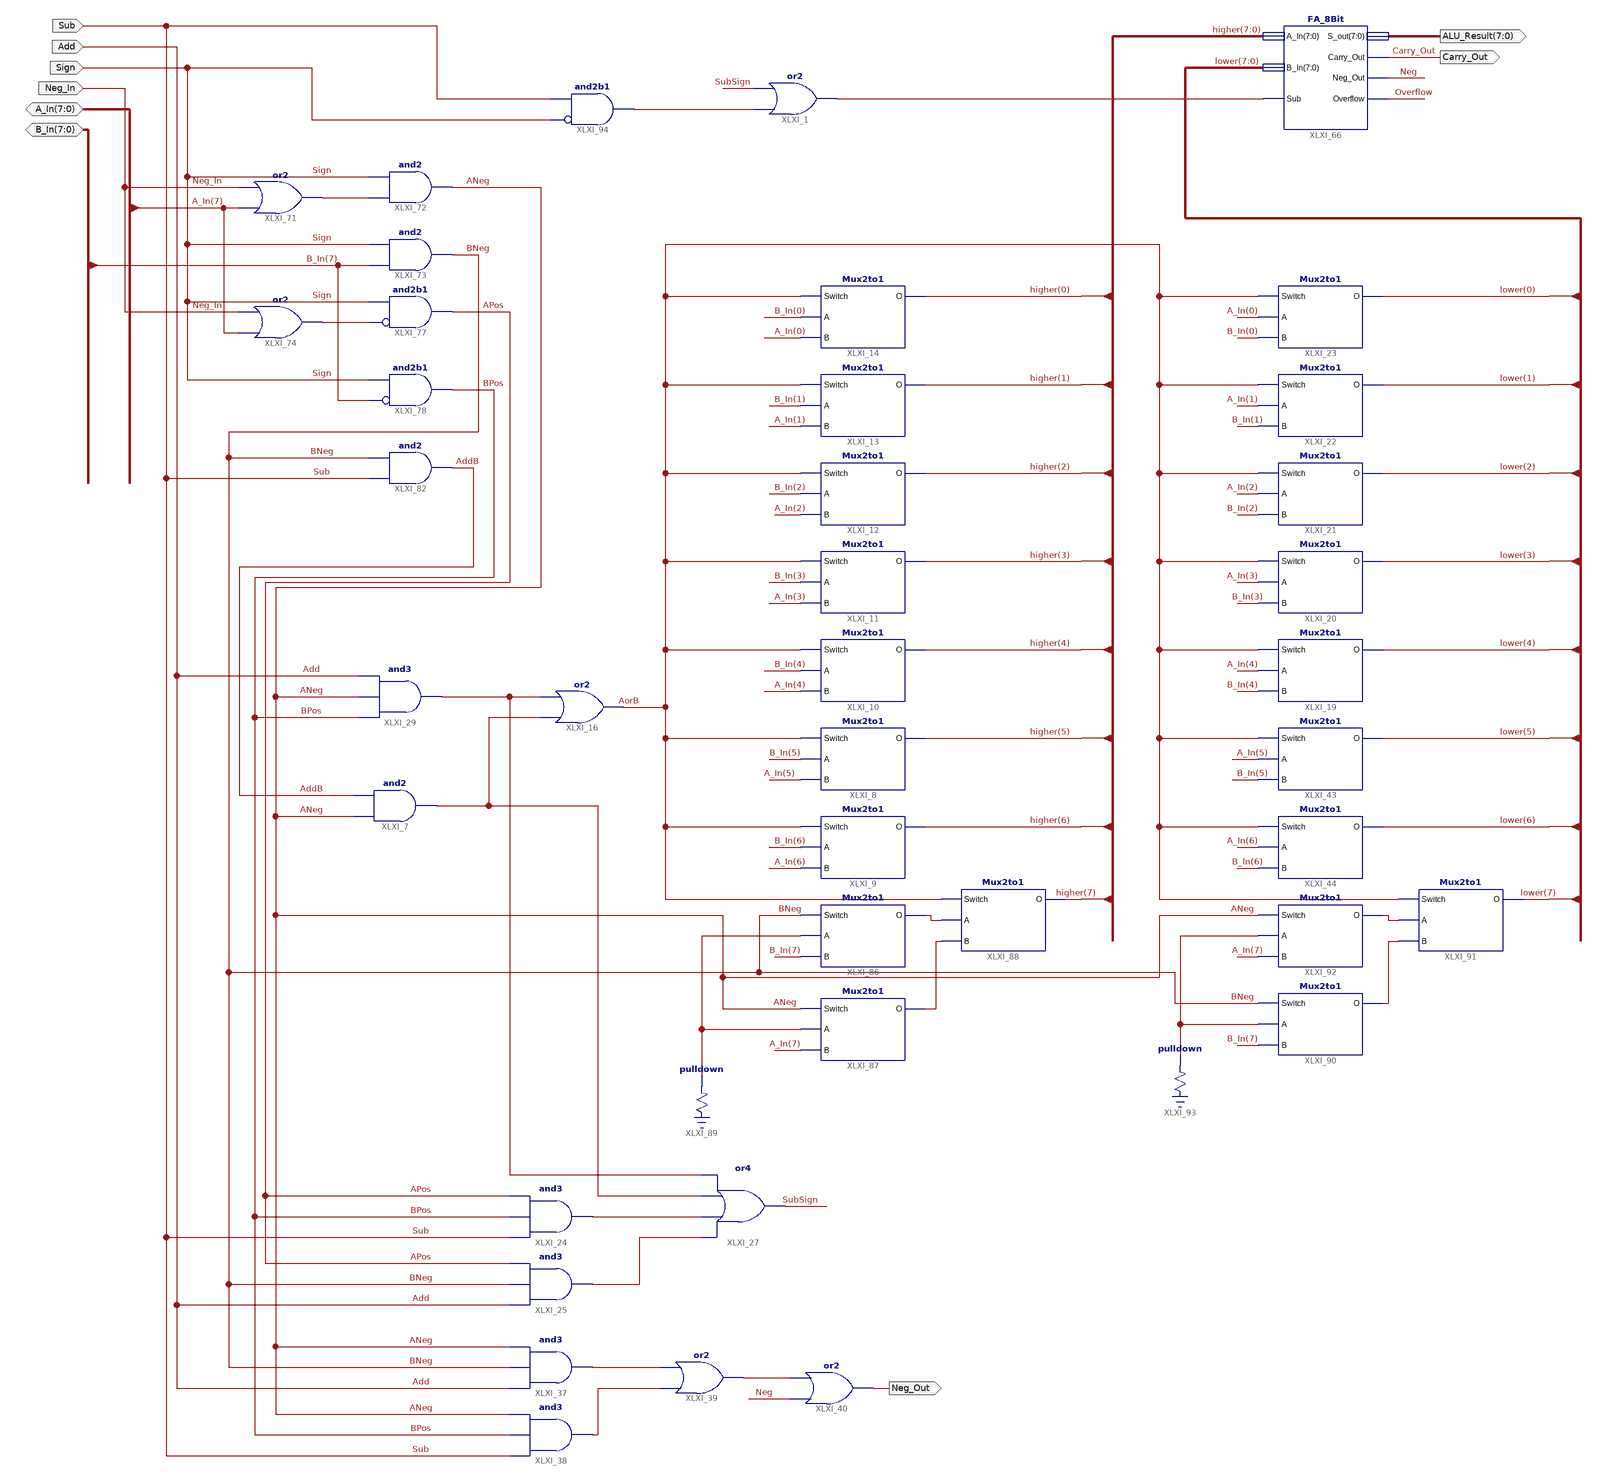
[diagram p0: schematic sheet 1]
// Xilinx ISE schematic ALU.sch (spartan3e) as structural Verilog: 42 symbols, 9 ports
module ALU (
  input  Neg_In,
  input  Sign,
  input  Sub,
  input  Add,
  inout  [7:0] A_In,
  inout  [7:0] B_In,
  output [7:0] ALU_Result,
  output Carry_Out,
  output Neg_Out
);

  wire AddB, ANeg, AorB, APos, BNeg, BPos, Neg, Overflow, SubSign, XLXN_4, XLXN_50, XLXN_53, XLXN_73,
       XLXN_276, XLXN_278, XLXN_369, XLXN_370, XLXN_371, XLXN_395, XLXN_396, XLXN_399, XLXN_468, XLXN_470,
       XLXN_471, XLXN_472, XLXN_473;
  wire [7:0] higher, lower;

  or XLXI_1 (XLXN_4, XLXN_468, SubSign);
  and XLXI_73 (BNeg, B_In[7], Sign);
  and XLXI_77 (APos, ~XLXN_278, Sign);  // and2b1
  or XLXI_74 (XLXN_278, A_In[7], Neg_In);
  and XLXI_72 (ANeg, XLXN_276, Sign);
  and XLXI_78 (BPos, ~B_In[7], Sign);  // and2b1
  and XLXI_7 (XLXN_471, ANeg, AddB);
  Mux2to1 XLXI_8 (.Switch(AorB), .A(B_In[5]), .B(A_In[5]), .O(higher[5]));
  Mux2to1 XLXI_9 (.Switch(AorB), .A(B_In[6]), .B(A_In[6]), .O(higher[6]));
  Mux2to1 XLXI_10 (.Switch(AorB), .A(B_In[4]), .B(A_In[4]), .O(higher[4]));
  Mux2to1 XLXI_11 (.Switch(AorB), .A(B_In[3]), .B(A_In[3]), .O(higher[3]));
  Mux2to1 XLXI_12 (.Switch(AorB), .A(B_In[2]), .B(A_In[2]), .O(higher[2]));
  Mux2to1 XLXI_13 (.Switch(AorB), .A(B_In[1]), .B(A_In[1]), .O(higher[1]));
  Mux2to1 XLXI_14 (.Switch(AorB), .A(B_In[0]), .B(A_In[0]), .O(higher[0]));
  Mux2to1 XLXI_86 (.Switch(BNeg), .A(XLXN_371), .B(B_In[7]), .O(XLXN_369));
  or XLXI_16 (AorB, XLXN_471, XLXN_470);
  Mux2to1 XLXI_44 (.Switch(AorB), .A(A_In[6]), .B(B_In[6]), .O(lower[6]));
  Mux2to1 XLXI_43 (.Switch(AorB), .A(A_In[5]), .B(B_In[5]), .O(lower[5]));
  Mux2to1 XLXI_19 (.Switch(AorB), .A(A_In[4]), .B(B_In[4]), .O(lower[4]));
  Mux2to1 XLXI_20 (.Switch(AorB), .A(A_In[3]), .B(B_In[3]), .O(lower[3]));
  Mux2to1 XLXI_21 (.Switch(AorB), .A(A_In[2]), .B(B_In[2]), .O(lower[2]));
  Mux2to1 XLXI_22 (.Switch(AorB), .A(A_In[1]), .B(B_In[1]), .O(lower[1]));
  Mux2to1 XLXI_23 (.Switch(AorB), .A(A_In[0]), .B(B_In[0]), .O(lower[0]));
  Mux2to1 XLXI_90 (.Switch(BNeg), .A(XLXN_399), .B(B_In[7]), .O(XLXN_396));
  Mux2to1 XLXI_92 (.Switch(ANeg), .A(XLXN_399), .B(A_In[7]), .O(XLXN_395));
  Mux2to1 XLXI_88 (.Switch(AorB), .A(XLXN_369), .B(XLXN_370), .O(higher[7]));
  Mux2to1 XLXI_91 (.Switch(AorB), .A(XLXN_395), .B(XLXN_396), .O(lower[7]));
  FA_8Bit XLXI_66 (
    .B_In(lower), .A_In(higher), .Sub(XLXN_4), .Overflow(Overflow), .Neg_Out(Neg), .Carry_Out(Carry_Out),
    .S_out(ALU_Result));
  and XLXI_29 (XLXN_470, BPos, ANeg, Add);
  and XLXI_24 (XLXN_73, Sub, BPos, APos);
  and XLXI_25 (XLXN_50, Add, BNeg, APos);
  \pulldown  XLXI_89 (.O(XLXN_371));
  \pulldown  XLXI_93 (.O(XLXN_399));
  or XLXI_27 (SubSign, XLXN_50, XLXN_73, XLXN_471, XLXN_470);
  and XLXI_82 (AddB, Sub, BNeg);
  and XLXI_94 (XLXN_468, ~Sign, Sub);  // and2b1
  and XLXI_37 (XLXN_472, Add, BNeg, ANeg);
  and XLXI_38 (XLXN_473, Sub, BPos, ANeg);
  or XLXI_39 (XLXN_53, XLXN_473, XLXN_472);
  or XLXI_40 (Neg_Out, Neg, XLXN_53);
  Mux2to1 XLXI_87 (.Switch(ANeg), .A(XLXN_371), .B(A_In[7]), .O(XLXN_370));
  or XLXI_71 (XLXN_276, A_In[7], Neg_In);
endmodule
